# EAGLE schematic Quad_circuit_Dejun_Ryan (EAGLE 7.2.0)
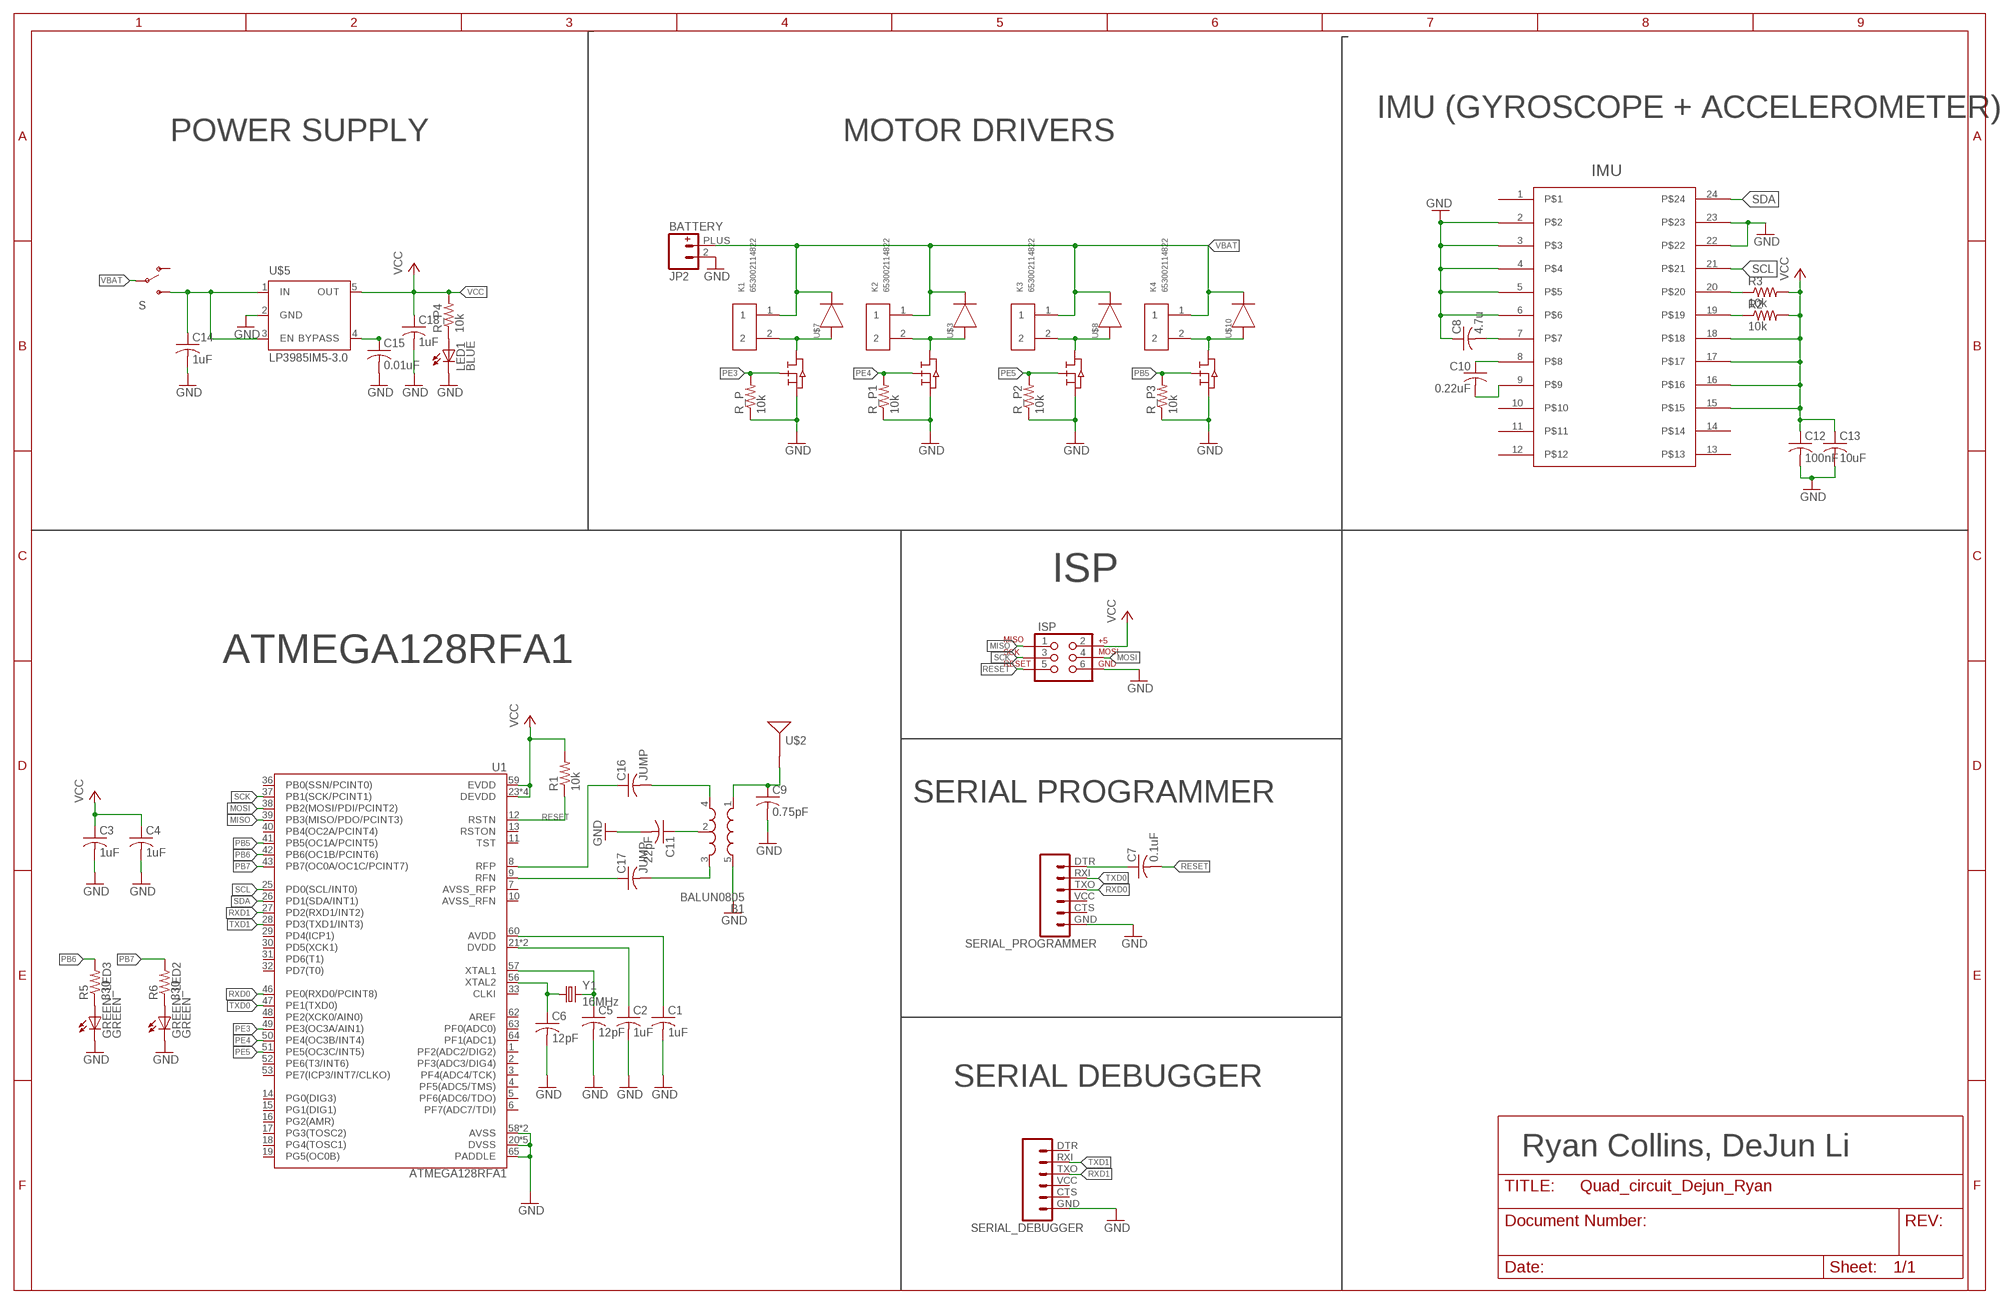
[diagram p0: schematic, sheet 1]

## Parts
B1  BALUN0805  [BALUN]
C1  1uF  C-USC0805  [C0805]
C2  1uF  C-USC0805  [C0805]
C3  1uF  C-USC0805  [C0805]
C4  1uF  C-USC0805  [C0805]
C5  12pF  C-USC0805  [C0805]
C6  12pF  C-USC0805  [C0805]
C7  0.1uF  C-USC0805  [C0805]
C8  4.7u  C-USC0805  [C0805]
C9  0.75pF  C-USC0805  [C0805]
C10  0.22uF  C-USC0805  [C0805]
C11  22pF  C-USC0805  [C0805]
C12  100nF  C-USC0805  [C0805]
C13  10uF  C-USC0805  [C0805]
C14  1uF  C-USC0805  [C0805]
C15  0.01uF  C-USC0805  [C0805]
C16  JUMP  C-USC0805  [C0805]
C17  JUMP  C-USC0805  [C0805]
C18  1uF  C-USC0805  [C0805]
GREEN_LED2  GREEN  LEDCHIP-LED0805  [CHIP-LED0805]
GREEN_LED3  GREEN  LEDCHIP-LED0805  [CHIP-LED0805]
IMU  IMU_LSM9DS0  [IMU_LSM9DS0]
ISP  AVR_SPI_PRG_6NS  [2X3-NS]
JP2  BATTERY  M02PTH  [1X02]
K1  653002114822  [653002114822]
K2  653002114822  [653002114822]
K3  653002114822  [653002114822]
K4  653002114822  [653002114822]
LED1  BLUE  LEDCHIP-LED0805  [CHIP-LED0805]
R1  10k  R-US_R0805  [R0805]
R2  10k  R-US_R0805  [R0805]
R3  10k  R-US_R0805  [R0805]
R5  330  R-US_R0805  [R0805]
R6  330  R-US_R0805  [R0805]
R_P  10k  R-US_R0805  [R0805]
R_P1  10k  R-US_R0805  [R0805]
R_P2  10k  R-US_R0805  [R0805]
R_P3  10k  R-US_R0805  [R0805]
R_P4  10k  R-US_R0805  [R0805]
S  WEEEEEE  SWITCH-SPDTPTH  [SWITCH-SPDT]
SERIAL_DEBUGGER  FTDI_BASICPTH  [FTDI_BASIC]
SERIAL_PROGRAMMER  FTDI_BASICPTH  [FTDI_BASIC]
U1  ATMEGA128RFA1  [QFN-64]
U$1  MOSFET-SI2302CDS  [MOSFET-SI2302CDS]
U$2  ANTENNA2SMD5  [ANTENNA-CHIP5]
U$3  DIODE  DIODE-BAS16WS  [DIODE-BAS16WS]
U$4  MOSFET-SI2302CDS  [MOSFET-SI2302CDS]
U$5  LP3985IM5-3.0  [SOT23-DBV]
U$6  MOSFET-SI2302CDS  [MOSFET-SI2302CDS]
U$7  DIODE  DIODE-BAS16WS  [DIODE-BAS16WS]
U$8  DIODE  DIODE-BAS16WS  [DIODE-BAS16WS]
U$9  MOSFET-SI2302CDS  [MOSFET-SI2302CDS]
U$10  DIODE  DIODE-BAS16WS  [DIODE-BAS16WS]
Y1  16MHz  CRYSTAL5X3  [CRYSTAL-SMD-5X3]

## Nets
GND: B1.5(GND) C1.2 C2.2 C3.2 C4.2 C5.2 C6.2 C8.1 C9.2 C11.2 C12.2 C13.2 C14.2 C15.2 C18.2 GREEN_LED2.C GREEN_LED3.C IMU.2 IMU.3 IMU.4 IMU.5 IMU.6 IMU.22 IMU.23 ISP.6 JP2.2 LED1.C R_P1.1 R_P2.1 R_P3.1 R_P.1 SERIAL_DEBUGGER.GND SERIAL_PROGRAMMER.GND U1.20(DVSS) U1.24(DVSS) U1.35(DVSS) U1.45(DVSS) U1.55(DVSS) U1.58(AVSS) U1.61(AVSS) U1.65(PADDLE) U$1.SOURCE(S) U$4.SOURCE(S) U$5.2(GND) U$6.SOURCE(S) U$9.SOURCE(S)
MISO: ISP.1 U1.39(PB3(MISO/PDO/PCINT3))
MOSI: ISP.4 U1.38(PB2(MOSI/PDI/PCINT2))
N$1: GREEN_LED3.A R5.1
N$2: GREEN_LED2.A R6.1
N$4: C7.1 SERIAL_PROGRAMMER.DTR
N$5: IMU.20 R3.1
N$6: IMU.19 R2.1
N$9: C6.1 U1.56(XTAL2) Y1.1
N$10: C5.1 U1.57(XTAL1) Y1.3
N$11: C2.1 U1.21(DVDD) U1.22(DVDD)
N$12: C1.1 U1.60(AVDD)
N$13: B1.2(GND) C11.1
N$14: B1.4(OUT1) C16.2
N$15: B1.3(OUT2) C17.2
N$16: C16.1 U1.8(RFP)
N$17: C17.1 U1.9(RFN)
N$18: B1.1(IN) C9.1 U$2.FEED(SIGNAL)
N$20: K1.2 U$6.DRAIN(D) U$7.ANODE(A)
N$21: C15.1 U$5.4(BYPASS)
N$22: K2.2 U$1.DRAIN(D) U$3.ANODE(A)
N$23: C8.2 IMU.7
N$24: C10.1 IMU.8
N$25: C10.2 IMU.9
N$26: C14.1 S.3(S) U$5.1(IN) U$5.3(EN)
N$27: K3.2 U$4.DRAIN(D) U$8.ANODE(A)
N$28: LED1.A R_P4.1
N$29: K4.2 U$9.DRAIN(D) U$10.ANODE(A)
PB5: R_P3.2 U1.41(PB5(OC1A/PCINT5)) U$9.GATE(G)
PB6: R5.2 U1.42(PB6(OC1B/PCINT6))
PB7: R6.2 U1.43(PB7(OC0A/OC1C/PCINT7))
PE3: R_P.2 U1.49(PE3(OC3A/AIN1)) U$6.GATE(G)
PE4: R_P1.2 U1.50(PE4(OC3B/INT4)) U$1.GATE(G)
PE5: R_P2.2 U1.51(PE5(OC3C/INT5)) U$4.GATE(G)
RESET: C7.2 ISP.5 R1.1 U1.12(RSTN)
RXD0: SERIAL_PROGRAMMER.TXO U1.46(PE0(RXD0/PCINT8))
RXD1: SERIAL_DEBUGGER.TXO U1.27(PD2(RXD1/INT2))
SCK: ISP.3 U1.37(PB1(SCK/PCINT1))
SCL: IMU.21 U1.25(PD0(SCL/INT0))
SDA: IMU.24 U1.26(PD1(SDA/INT1))
TXD0: SERIAL_PROGRAMMER.RXI U1.47(PE1(TXD0))
TXD1: SERIAL_DEBUGGER.RXI U1.28(PD3(TXD1/INT3))
VBAT: JP2.PLUS K1.1 K2.1 K3.1 K4.1 S.2(P) U$3.CATHODE(C) U$7.CATHODE(C) U$8.CATHODE(C) U$10.CATHODE(C)
VCC: C3.1 C4.1 C12.1 C13.1 C18.1 IMU.15 IMU.16 IMU.17 IMU.18 ISP.2 R1.2 R2.2 R3.2 R_P4.2 U1.23(DEVDD) U1.34(DEVDD) U1.44(DEVDD) U1.54(DEVDD) U1.59(EVDD) U$5.5(OUT)
Unconnected: IMU.1 IMU.10 IMU.11 IMU.12 IMU.13 IMU.14 S.1(O) SERIAL_DEBUGGER.CTS SERIAL_DEBUGGER.DTR SERIAL_DEBUGGER.VCC SERIAL_PROGRAMMER.CTS SERIAL_PROGRAMMER.VCC U1.1(PF2(ADC2/DIG2)) U1.2(PF3(ADC3/DIG4)) U1.3(PF4(ADC4/TCK)) U1.4(PF5(ADC5/TMS)) U1.5(PF6(ADC6/TDO)) U1.6(PF7(ADC7/TDI)) U1.7(AVSS_RFP) U1.10(AVSS_RFN) U1.11(TST) U1.13(RSTON) U1.14(PG0(DIG3)) U1.15(PG1(DIG1)) U1.16(PG2(AMR)) U1.17(PG3(TOSC2)) U1.18(PG4(TOSC1)) U1.19(PG5(OC0B)) U1.29(PD4(ICP1)) U1.30(PD5(XCK1)) U1.31(PD6(T1)) U1.32(PD7(T0)) U1.33(CLKI) U1.36(PB0(SSN/PCINT0)) U1.40(PB4(OC2A/PCINT4)) U1.48(PE2(XCK0/AIN0)) U1.52(PE6(T3/INT6)) U1.53(PE7(ICP3/INT7/CLKO)) U1.62(AREF) U1.63(PF0(ADC0)) U1.64(PF1(ADC1))

## Notes on the sheet
- IMU (GYROSCOPE + ACCELEROMETER)
- POWER SUPPLY | MOTOR DRIVERS
- ISP
- ATMEGA128RFA1
- SERIAL PROGRAMMER
- SERIAL DEBUGGER
- Ryan Collins, DeJun Li

## Library data of the parts
B1 = Lab5:BALUN: 0805 footprint balun- Ember 351/357
C1-C18 = Lab5:C-US: CAPACITOR, American symbol
GREEN_LED2 GREEN_LED3 LED1 = Lab5:LED: LED OSRAM: - CHIPLED LG R971, LG N971, LY N971, LG Q971, LY Q971, LO R971, LY R971 LH N974, LH R974 LS Q976, LO Q976, LY Q976 LO Q996 - Hyper CHIPLED LW Q18S LB Q993, LB Q99A, LB R99A - SideLED LS A670, LO A670, LY A670, LG A670, LP A670 LB A673, LV A673, LT A673, LW A673 LH A674 LY A675 LS A676, LA A676, LO A676, LY A676, LW A676 LS A679, LY A679, LG A679 - Hyper Micro SIDELED® LS Y876, LA Y876, LO Y876, LY Y876 LT Y87S - SmartLED LW L88C, LW L88S LB L89C, LB L89S, LG L890 LS L89K, LO L89K, LY L89K LS L896, LA L896, LO L896, LY L896 - TOPLED LS T670, LO T670, LY T670, LG T670, LP T670 LSG T670, LSP T670, LSY T670, LOP T670, LYG T670 LG T671, LOG T671, LSG T671 LB T673, LV T673, LT T673, LW T673 LH T674 LS T676, LA T676, LO T676, LY T676, LB T676, LH T676, LSB T676, LW T676 LB T67C, LV T67C, LT T67C, LS T67K, LO T67K, LY T67K, LW E67C LS E67B, LA E67B, LO E67B, LY E67B, LB E67C, LV E67C, LT E67C LW T67C LS T679, LY T679, LG T679 LS T770, LO T770, LY T770, LG T770, LP T770 LB T773, LV T773, LT T773, LW T773 LH T774 LS E675, LA E675, LY E675, LS T675 LS T776, LA T776, LO T776, LY T776, LB T776 LHGB T686 LT T68C, LB T68C - Hyper Mini TOPLED® LB M676 - Mini TOPLED Santana® LG M470 LS M47K, LO M47K, LY M47K Source: http://www.osram.convergy.de LUXEON: - LUMILED® LXK2-PW12-R00, LXK2-PW12-S00, LXK2-PW14-U00, LXK2-PW14-V00 LXK2-PM12-R00, LXK2-PM12-S00, LXK2-PM14-U00 LXK2-PE12-Q00, LXK2-PE12-R00, LXK2-PE12-S00, LXK2-PE14-T00, LXK2-PE14-U00 LXK2-PB12-K00, LXK2-PB12-L00, LXK2-PB12-M00, LXK2-PB14-N00, LXK2-PB14-P00, LXK2-PB14-Q00 LXK2-PR12-L00, LXK2-PR12-M00, LXK2-PR14-Q00, LXK2-PR14-R00 LXK2-PD12-Q00, LXK2-PD12-R00, LXK2-PD12-S00 LXK2-PH12-R00, LXK2-PH12-S00 LXK2-PL12-P00, LXK2-PL12-Q00, LXK2-PL12-R00 Source: www.luxeon.com KINGBRIGHT: KA-3528ASYC Source: www.kingbright.com
IMU = RyanCollins_Lab4:IMU_LSM9DS0
ISP = Lab5:AVR_SPI_PRG_6: AVR ISP 6 Pin This is the reduced ISP connector for AVR programming. Common on Arduino. This footprint will take up less PCB space and can be used with a 10-pin to 6-pin adapter such as SKU: BOB-08508
JP2 = Lab5:M02: Header 2 Standard 2-pin 0.1" header. Use with straight break away headers (SKU : PRT-00116), right angle break away headers (PRT-00553), swiss pins (PRT-00743), machine pins (PRT-00117), and female headers (PRT-00115). Molex polarized connector foot print use with SKU : PRT-08233 with associated crimp pins and housings.
K1-K4 = Lab5:653002114822: WR-WTB 1.25mm Male Vertical Shrouded Header, 2 Pins=>Code : Con_WTB_1.25_PCB_THT_653002114822 <http://katalog.we-online.de/media/thumbs2/eican/thb_Con_WTB_1.25_PCB_THT_6530xx114822_pf2.jpg> Details see: http://katalog.we-online.de/en/em/653_0xx_114_822 Created 2014-06-06, Karrer Zheng 2014 (C) Würth Elektronik
R1-R3 R5 R6 R_P R_P1-R_P4 = Lab5:R-US_: RESISTOR, American symbol
S = Lab5:SWITCH-SPDT: SPDT Switch Simple slide switch, Spark Fun Electronics SKU : COM-00102 DPDT SMT slide switch, AYZ0202, SWCH-08179; PROD_ID: SWCH-08261
SERIAL_DEBUGGER SERIAL_PROGRAMMER = Lab5:FTDI_BASIC: FTDI Basic header with labels
U1 = Lab5:ATMEGA128RFA1: ATmega128RFA1 8-bit AVR Microcontroller with Low Power 2.4GHz Transceiver for ZigBee and IEEE 802.15.4
U$1 U$4 U$6 U$9 = DeJun-lab4:MOSFET-SI2302CDS; CREATOR: DEJUN; DISP: DIGIKEY; DISPPN: SI2302CDS-T1-E3TR-ND
U$2 = Lab5:ANTENNA2: Chip antenna Single endded antenna. Common with smaller chip antennas. CHIP4 package is the GPS Chip Antenna SKU: GPS-08418. CHIP5 package is 2.4GHz chip antenna SKU: WRL-00144.
U$3 U$7 U$8 U$10 = DeJun-lab4:DIODE-BAS16WS; CREATOR: DEJUN; DISP: DIGIKEY; DISPPN: BAS16WS-E3-08CT-ND
U$5 = Lab5:LP3985IM5-3.0
Y1 = Lab5:CRYSTAL: Various standard crystals. Proven footprints. Spark Fun Electronics SKU : COM-00534